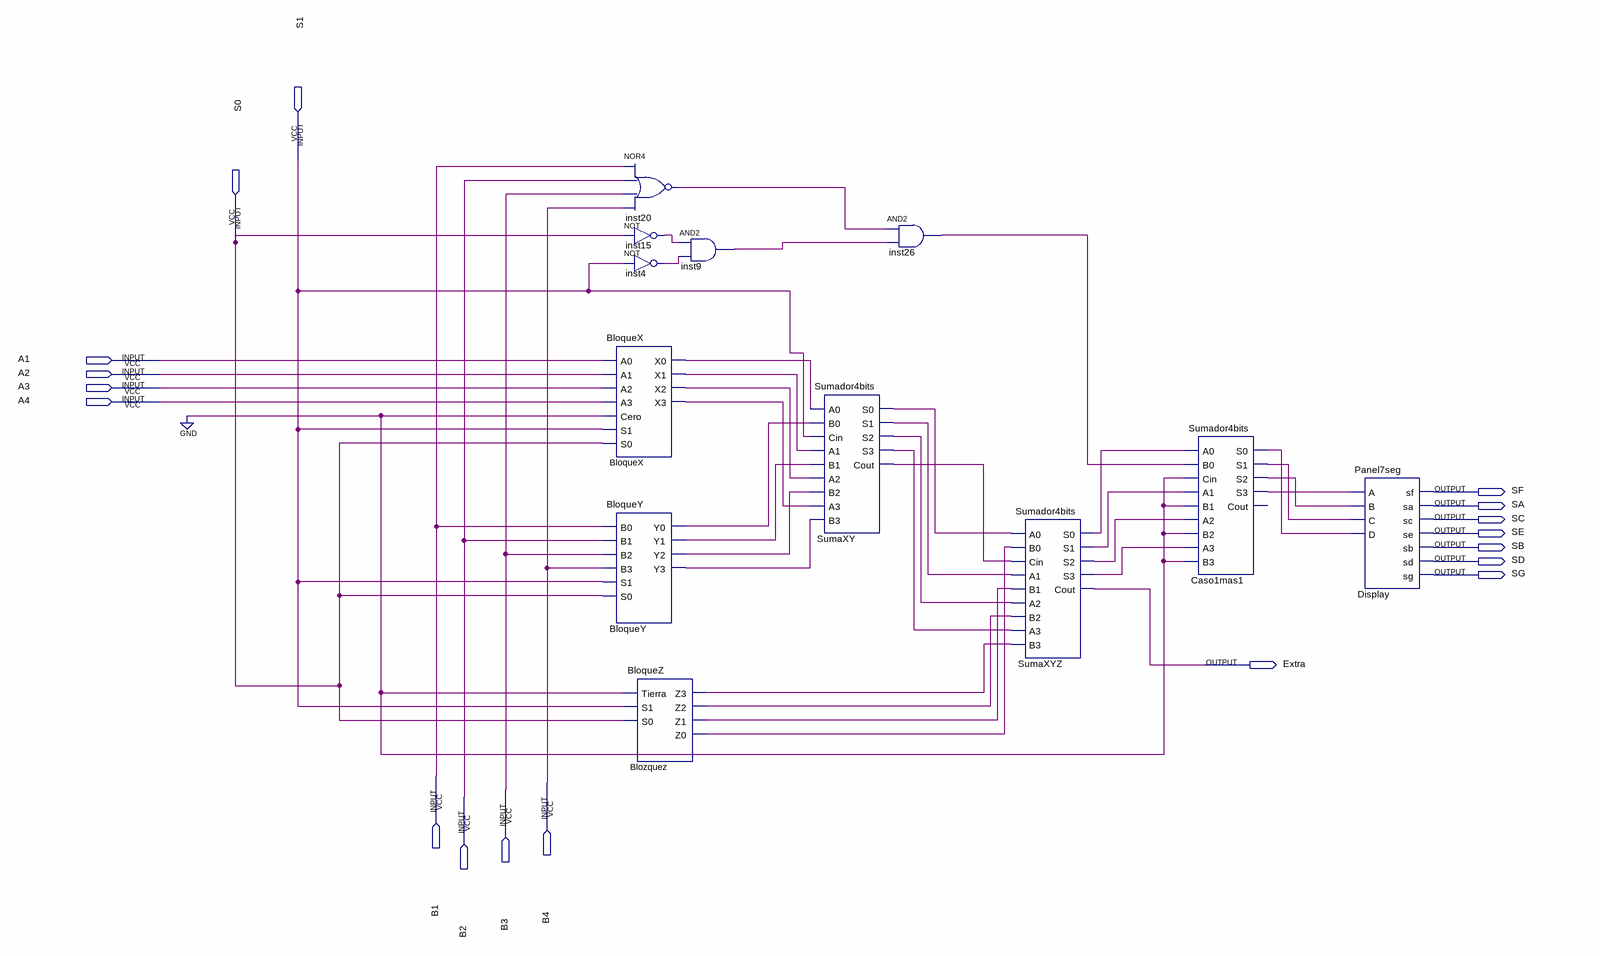
[diagram p0: schematic sheet]
// Quartus schematic AritAlu.bdf as structural Verilog: 12 symbols, 18 pins
module AritAlu (
  input  S1,
  input  S0,
  input  A1,
  input  A2,
  input  A3,
  input  A4,
  input  B1,
  input  B4,
  input  B3,
  input  B2,
  output SF,
  output SA,
  output SC,
  output SE,
  output SB,
  output SD,
  output SG,
  output Extra
);

  wire BloqueX_x0, BloqueX_x1, BloqueX_x2, BloqueX_x3, BloqueY_y0, BloqueY_y1, BloqueY_y2, BloqueY_y3,
       Blozquez_z0, Blozquez_z1, Blozquez_z2, Blozquez_z3, Caso1mas1_s0, Caso1mas1_s1, Caso1mas1_s2,
       Caso1mas1_s3, inst4_out, inst9_out, inst15_out, inst20_out, inst26_out, SumaXY_cout, SumaXY_s0,
       SumaXY_s1, SumaXY_s2, SumaXY_s3, SumaXYZ_s0, SumaXYZ_s1, SumaXYZ_s2, SumaXYZ_s3;

  nor inst20 (inst20_out, B1, B2, B3, B4);
  not inst15 (inst15_out, S0);
  not inst4 (inst4_out, S1);
  BloqueX BloqueX (
    .A0(A1), .A1(A2), .A2(A3), .A3(A4), .Cero(1'b0), .S1(S1), .S0(S0), .X0(BloqueX_x0), .X1(BloqueX_x1),
    .X2(BloqueX_x2), .X3(BloqueX_x3));
  BloqueY BloqueY (
    .B0(B1), .B1(B2), .B2(B3), .B3(B4), .S1(S1), .S0(S0), .Y0(BloqueY_y0), .Y1(BloqueY_y1), .Y2(BloqueY_y2),
    .Y3(BloqueY_y3));
  BloqueZ Blozquez (
    .Tierra(1'b0), .S1(S1), .S0(S0), .Z3(Blozquez_z3), .Z2(Blozquez_z2), .Z1(Blozquez_z1), .Z0(Blozquez_z0));
  and inst9 (inst9_out, inst15_out, inst4_out);
  Sumador4bits SumaXY (
    .A0(BloqueX_x0), .B0(BloqueY_y0), .Cin(S1), .A1(BloqueX_x1), .B1(BloqueY_y1), .A2(BloqueX_x2),
    .B2(BloqueY_y2), .A3(BloqueX_x3), .B3(BloqueY_y3), .S0(SumaXY_s0), .S1(SumaXY_s1), .S2(SumaXY_s2),
    .S3(SumaXY_s3), .Cout(SumaXY_cout));
  and inst26 (inst26_out, inst20_out, inst9_out);
  Sumador4bits SumaXYZ (
    .A0(SumaXY_s0), .B0(Blozquez_z0), .Cin(SumaXY_cout), .A1(SumaXY_s1), .B1(Blozquez_z1), .A2(SumaXY_s2),
    .B2(Blozquez_z2), .A3(SumaXY_s3), .B3(Blozquez_z3), .S0(SumaXYZ_s0), .S1(SumaXYZ_s1), .S2(SumaXYZ_s2),
    .S3(SumaXYZ_s3), .Cout(Extra));
  Sumador4bits Caso1mas1 (
    .A0(SumaXYZ_s0), .B0(inst26_out), .Cin(1'b0), .A1(SumaXYZ_s1), .B1(1'b0), .A2(SumaXYZ_s2), .B2(1'b0),
    .A3(SumaXYZ_s3), .B3(1'b0), .S0(Caso1mas1_s0), .S1(Caso1mas1_s1), .S2(Caso1mas1_s2), .S3(Caso1mas1_s3));  // open: Cout
  Panel7seg Display (
    .A(Caso1mas1_s3), .B(Caso1mas1_s2), .C(Caso1mas1_s1), .D(Caso1mas1_s0), .sf(SF), .sa(SA), .sc(SC),
    .se(SE), .sb(SB), .sd(SD), .sg(SG));
endmodule
